# Altium schematic sheet FPGA_165B_StopWatch_7SEG.SchDoc: LiveDesign Evaluation - Stop Watch
size B; Organization: Altium Limited; Address1: L3, 12a Rodborough Rd; Address2: Frenchs Forest; Address3: NSW; Address4: Australia 2086; DocumentNumber: 1; SheetNumber: 1; SheetTotal: 3
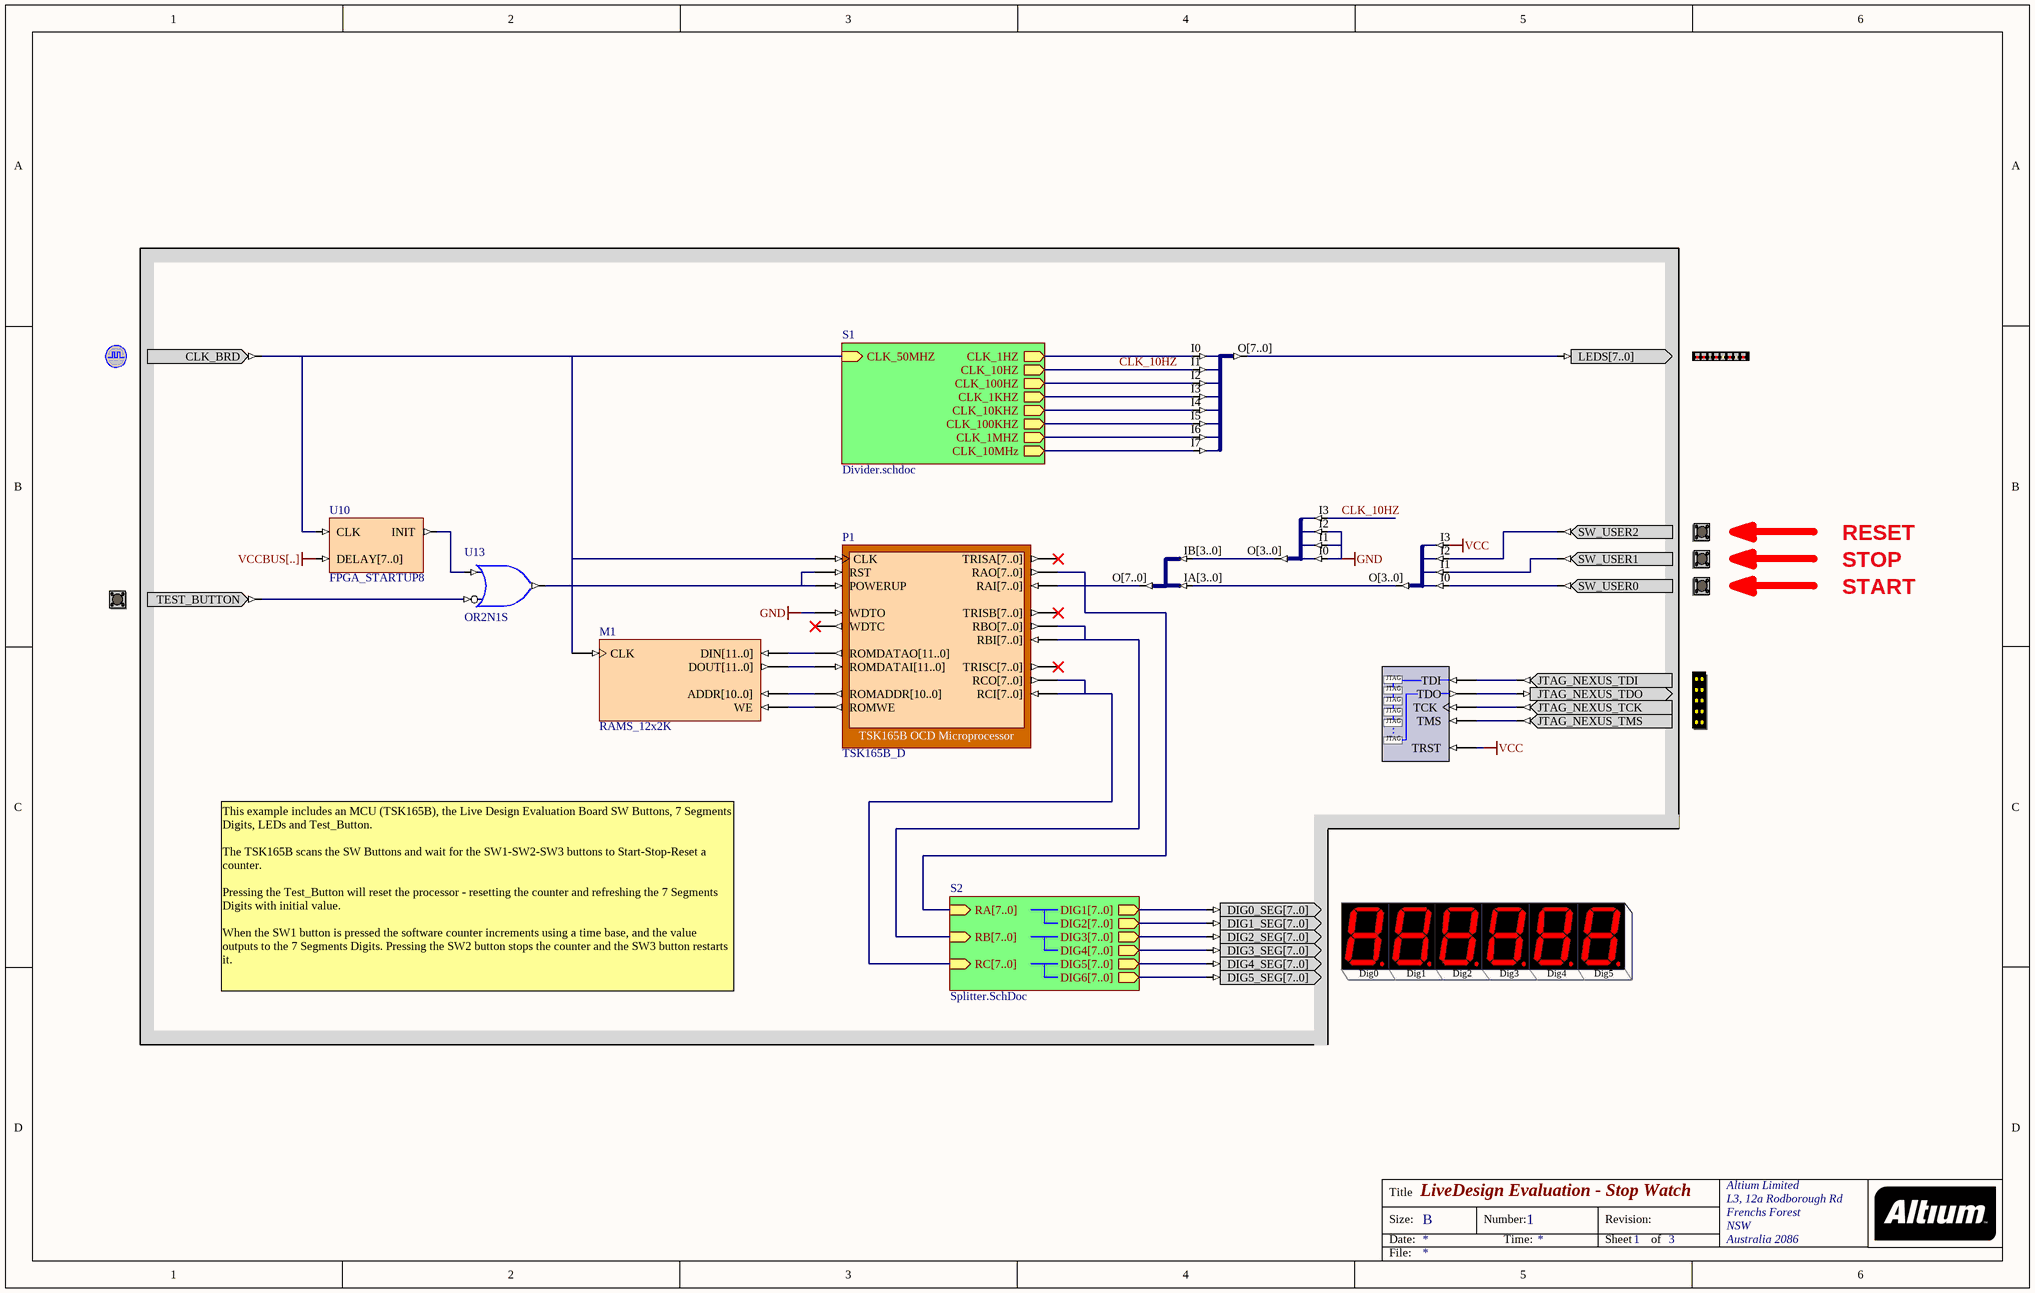
[diagram p0: FPGA_165B_StopWatch_7SEG.SchDoc]

## Parts
7SEGX6  7SEGX6  (value not drawn)
CLOCK_BOARD  CLOCK_BOARD  (value not drawn)
LED  LED  (value not drawn)
M1  RAMS_12x2K
NEXUS_JTAG_CONNECTOR  NEXUS_JTAG_CONNECTOR  (value not drawn)
NEXUS_JTAG_PORT  NEXUS_JTAG_PORT  (value not drawn)
P1  TSK165B_D
TEST_BUTTON  TEST_BUTTON  (value not drawn)
U9  J8S_8B  (value not drawn)
U10  FPGA_STARTUP8
U11  J4S_4B  (value not drawn)
U12  J4S_4B  (value not drawn)
U13  OR2N1S
U14  J4B2_8B  (value not drawn)
USER_BUTTON0  USER_BUTTON0  (value not drawn)
USER_BUTTON1  USER_BUTTON1  (value not drawn)
USER_BUTTON2  USER_BUTTON2  (value not drawn)

## Sub-sheets
S1 = Divider.schdoc: CLK_50MHZ (in), CLK_10HZ (out), CLK_100HZ (out), CLK_1KHZ (out), CLK_10KHZ (out), CLK_100KHZ (out), CLK_1MHZ (out), CLK_1HZ (out), CLK_10MHz (out)
S2 = Splitter.SchDoc: DIG1[7..0] (out), DIG2[7..0] (out), DIG3[7..0] (out), DIG4[7..0] (out), DIG5[7..0] (out), DIG6[7..0] (out), RA[7..0] (in), RB[7..0] (in), RC[7..0] (in)

## Nets
GND: P1.WDTO U12.I0 U12.I1 U12.I2
VCC: NEXUS_JTAG_PORT.TRST U11.I3
VCCBUS[..]: U10.DELAY[7..0]
CLK_10HZ: U9.I1 U12.I3 ; sheet S1/CLK_10HZ
Net7SEGX6_DIG0_SEG[7..0]: 7SEGX6.DIG0_SEG[7..0] ; sheet S2/DIG1[7..0]
Net7SEGX6_DIG1_SEG[7..0]: 7SEGX6.DIG1_SEG[7..0] ; sheet S2/DIG2[7..0]
Net7SEGX6_DIG2_SEG[7..0]: 7SEGX6.DIG2_SEG[7..0] ; sheet S2/DIG3[7..0]
Net7SEGX6_DIG3_SEG[7..0]: 7SEGX6.DIG3_SEG[7..0] ; sheet S2/DIG4[7..0]
Net7SEGX6_DIG4_SEG[7..0]: 7SEGX6.DIG4_SEG[7..0] ; sheet S2/DIG5[7..0]
Net7SEGX6_DIG5_SEG[7..0]: 7SEGX6.DIG5_SEG[7..0] ; sheet S2/DIG6[7..0]
NetCLOCK_BOARD_CLK_BRD: CLOCK_BOARD.CLK_BRD M1.CLK P1.CLK U10.CLK ; sheet S1/CLK_50MHZ
NetLED_LEDS[7..0]: LED.LEDS[7..0] U9.O[7..0]
NetM1_ADDR[10..0]: M1.ADDR[10..0] P1.ROMADDR[10..0]
NetM1_DIN[11..0]: M1.DIN[11..0] P1.ROMDATAO[11..0]
NetM1_DOUT[11..0]: M1.DOUT[11..0] P1.ROMDATAI[11..0]
NetM1_WE: M1.WE P1.ROMWE
NetNEXUS_JTAG_CONNECTOR_JTAG_NEXUS_TCK: NEXUS_JTAG_CONNECTOR.JTAG_NEXUS_TCK NEXUS_JTAG_PORT.TCK
NetNEXUS_JTAG_CONNECTOR_JTAG_NEXUS_TDI: NEXUS_JTAG_CONNECTOR.JTAG_NEXUS_TDI NEXUS_JTAG_PORT.TDI
NetNEXUS_JTAG_CONNECTOR_JTAG_NEXUS_TDO: NEXUS_JTAG_CONNECTOR.JTAG_NEXUS_TDO NEXUS_JTAG_PORT.TDO
NetNEXUS_JTAG_CONNECTOR_JTAG_NEXUS_TMS: NEXUS_JTAG_CONNECTOR.JTAG_NEXUS_TMS NEXUS_JTAG_PORT.TMS
NetP1_POWERUP: P1.POWERUP P1.RST U13.O
NetP1_RAI[7..0]: P1.RAI[7..0] U14.O[7..0]
NetP1_RAO[7..0]: P1.RAO[7..0] ; sheet S2/RA[7..0]
NetP1_RBI[7..0]: P1.RBI[7..0] P1.RBO[7..0] ; sheet S2/RB[7..0]
NetP1_RCI[7..0]: P1.RCI[7..0] P1.RCO[7..0] ; sheet S2/RC[7..0]
NetTEST_BUTTON_TEST_BUTTON: TEST_BUTTON.TEST_BUTTON U13.I0
NetU9_I0: U9.I0 ; sheet S1/CLK_1HZ
NetU9_I2: U9.I2 ; sheet S1/CLK_100HZ
NetU9_I3: U9.I3 ; sheet S1/CLK_1KHZ
NetU9_I4: U9.I4 ; sheet S1/CLK_10KHZ
NetU9_I5: U9.I5 ; sheet S1/CLK_100KHZ
NetU9_I6: U9.I6 ; sheet S1/CLK_1MHZ
NetU9_I7: U9.I7 ; sheet S1/CLK_10MHz
NetU10_INIT: U10.INIT U13.I1
NetU11_I0: U11.I0 USER_BUTTON0.SW_USER0
NetU11_I1: U11.I1 USER_BUTTON1.SW_USER1
NetU11_I2: U11.I2 USER_BUTTON2.SW_USER2
NetU11_O[3..0]: U11.O[3..0] U14.IA[3..0]
NetU12_O[3..0]: U12.O[3..0] U14.IB[3..0]

Not connected (* = marked no-connect by the designer): P1 TRISA[7..0]* TRISB[7..0]* TRISC[7..0]* WDTC*

## Notes on the sheet
- RESET
- START
- STOP
- This example includes an MCU (TSK165B), the Live Design Evaluation Board SW Buttons, 7 Segments Digits, LEDs and Test_Button.
  The TSK165B scans the SW Buttons and wait for the SW1-SW2-SW3 buttons to Start-Stop-Reset a counter.
  Pressing the Test_Button will reset the processor - resetting the counter and refreshing the 7 Segments Digits with initial value.
  When the SW1 button is pressed the software counter increments using a time base, and the value outputs to the 7 Segments Digits. Pressing the SW2 button stops the counter and the SW3 button restarts it.
- Title
- Size:
- Date:
- B
- Number:
- Time:
- Revision:
- Sheet
- of
- File:
- (in symbol 7SEGX6) Dig0; Dig1; Dig2; Dig3; Dig4; Dig5
- (in symbol NEXUS_JTAG_PORT) JTAG; .

## Library data of the parts
7SEGX6 = 7SEGX6: 6 x 7 Segment display module; PortComponent: True; Publisher: Altium Limited; Published: 9-Sept-2004
CLOCK_BOARD = CLOCK_BOARD: Global System Clock Supply; PortComponent: True; Published: 19-Nov-2003; Publisher: Altium Limited
LED = LED: 8-Way LEDS; PortComponent: True; Published: 19-Nov-2003; Publisher: Altium Limited
M1 = RAMS_12x2K: Single Port Random Access Memory; Memory_Depth: 2048; Memory_Type: RAM_SinglePortBlock; Memory_Width: 12; Memory_ClockEdge: Rising; Nexus_Core: Memory_Program; Published: 13/01/2004; Publisher: Altium Hobart Technology Center
NEXUS_JTAG_CONNECTOR = NEXUS_JTAG_CONNECTOR: JTAG Port; PortComponent: True; Published: 19-Nov-2003; Publisher: Altium Limited
NEXUS_JTAG_PORT = NEXUS_JTAG_PORT: Soft Nexus-Chain Connector; NEXUS_JTAG_CONNECTOR: True; Published: 18-Dec-2003; Publisher: Altium Limited
P1 = TSK165B_D: TSK165B OCD Microprocessor; NEXUS_CORE: Processor_OCDS; NEXUS_JTAG_DEVICE: True; NEXUS_JTAG_ORDER: 0; ChildModel1: TSK165B_D_RAM128x8; ChildCore1: M1; Published: 1/12/2003; Publisher: Altium Hobart Technology Centre; Core Revision: 1.00.00
TEST_BUTTON = TEST_BUTTON: Test Button; PortComponent: True; Published: 19-Nov-2003; Publisher: Altium Limited
U9 = J8S_8B: 8 Single pin inputs to single 8-Bit output bus; ArchiveName: GENERIC; Published: 18-Nov-2003; Publisher: Altium Limited; Core Revision: 1.00.00
U10 = FPGA_STARTUP8: FPGA Startup With 8 Bit Delay; Published: 21/01/2004; Publisher: Altium Hobart Technology Centre; Core Revision: 1.00.00
U11 = J4S_4B: 4 Single pin inputs to single 4-Bit output bus; FunctionalClass: Bus Joiner; PortSize: 4; ArchiveName: GENERIC; VHDLIB_SIM: GENERIC_LIB; Published: 29-Jan-2004; Publisher: Altium Limited; LastRevisionNo: 1.00.00; HelpURL: CR0118 FPGA Generic Library Guide.pdf#page=305
U12 = J4S_4B: 4 Single pin inputs to single 4-Bit output bus; ArchiveName: GENERIC; Published: 18-Dec-2003; Publisher: Altium Limited; Core Revision: 1.00.00
U13 = OR2N1S: 2-Input OR Gate with Active Low A Input, Single Pin Version; Xilinx Equivalent: OR2B1; ArchiveName: GENERIC; Published: 18-Dec-2003; Publisher: Altium Limited; Core Revision: 1.00.00
U14 = J4B2_8B: 2 x 4-Bit input bus to 1 x 8-bit output bus; ArchiveName: GENERIC; Published: 18-Dec-2003; Publisher: Altium Limited; Core Revision: 1.00.00
USER_BUTTON0 = USER_BUTTON0: User Buttons; PortComponent: True; Published: 19-Nov-2003; Publisher: Altium Limited
USER_BUTTON1 = USER_BUTTON1: User Buttons; PortComponent: True; Published: 19-Nov-2003; Publisher: Altium Limited
USER_BUTTON2 = USER_BUTTON2: User Buttons; PortComponent: True; Published: 19-Nov-2003; Publisher: Altium Limited